# Altium schematic sheet DACN.SchDoc
size A
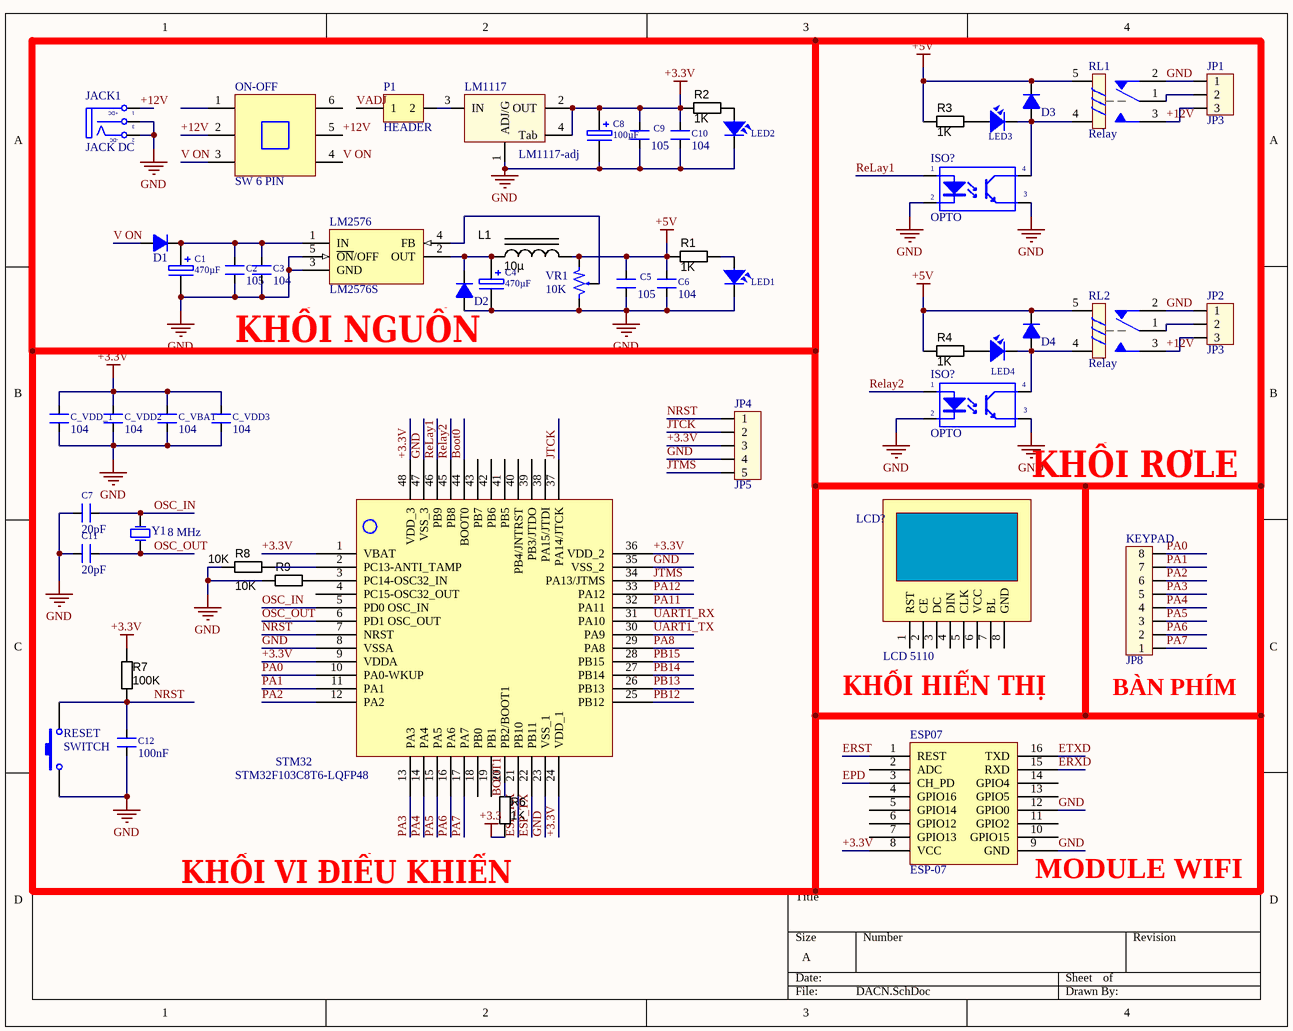
[diagram p0: DACN.SchDoc]

## Parts
(Parts that share a designator on the sheet are numbered #1, #2 ... from top to bottom, then left to right.)
C1  10µF  [CAP_ELEC_5x5.7]  (value not drawn)
C2  105  [SM-CAP-0805]
C3  104  [SM-CAP-0805]
C4  10µF  [CAP_ELEC_5x5.7]  (value not drawn)
C5  105  [SM-CAP-0805]
C6  104  [SM-CAP-0805]
C7  20pF  [SM-CAP-0805]
C8  10µF  [CAP_ELEC_5x5.7]  (value not drawn)
C9  105  [SM-CAP-0805]
C10  104  [SM-CAP-0805]
C11  20pF  [SM-CAP-0805]
C12  100nF  [SM-CAP-0805]
C_VBAT  104  [SM-CAP-0805]
C_VDD2  104  [SM-CAP-0805]
C_VDD3  104  [SM-CAP-0805]
C_VDD_1  104  [SM-CAP-0805]
D1  Diode  1N4007  [DO-214AC]  (value not drawn)
D2  Diode  1N4007  [DO-214AC]  (value not drawn)
D3  Diode  1N4007  [DO-214AC]  (value not drawn)
D4  Diode  1N4007  [DO-214AC]  (value not drawn)
ESP07  ESP-07  [ESP8266-07]
ISO?#1  OPTO  [PC817 SMD]
ISO?#2  OPTO  [PC817 SMD]
JACK1  JACK DC  [JACK DC]
JP1  JP3  [CON3]
JP2  JP3  [CON3]
JP4  JP5  [jam5]
KEYPAD  JP8  [jam8]
L1  10µ  [IND_WW_DR73]
LCD?  LCD 5110  [LCD 5110]
LED1  LED SMD  [SM-LED-0805-Blue]  (value not drawn)
LED2  LED SMD  [SM-LED-0805-Blue]  (value not drawn)
LED3  LED SMD  [SM-LED-0805-Blue]  (value not drawn)
LED4  LED SMD  [SM-LED-0805-Blue]  (value not drawn)
LM1117  LM1117-adj  [SOT223-4N]
LM2576  LM2576S  [TS5B]
ON-OFF  SW 6 PIN  [SW6]
P1  HEADER  [JUMPER PITCH 2 PIN]
R1  value 1K  [RESC2012N_ZERO]  (hidden comment: Jumper)
R2  value 1K  [RESC2012N_ZERO]  (hidden comment: Jumper)
R3  value 1K  [RESC2012N_ZERO]  (hidden comment: Jumper)
R4  value 1K  [RESC2012N_ZERO]  (hidden comment: Jumper)
R6  value 1K  [RESC2012N_ZERO]  (hidden comment: Jumper)
R7  value 100K  [RESC2012N_ZERO]  (hidden comment: Jumper)
R8  value 10K  [RESC2012N_ZERO]  (hidden comment: Jumper)
R9  value 10K  [RESC2012N_ZERO]  (hidden comment: Jumper)
RESET  SWITCH  [SW 4PIN]
RL1  Relay  [RL_SPDT_10A]
RL2  Relay  [RL_SPDT_10A]
STM32  STM32F103C8T6-LQFP48  [LQFP 48 PIN]
VR1  10K  [VR1]
Y1  8 MHz  [CRYSTAL DIP]

## Nets
+3.3: R6.1
+3.3V: C8.1 C9.2 C10.2 C_VBAT.2 C_VDD2.2 C_VDD3.2 C_VDD_1.2 ESP07.8(VCC) JP4.3 LM1117.2(OUT) LM1117.4(Tab) R2.1 R7.2 STM32.1(VBAT) STM32.9(VDDA) STM32.24(VDD_1) STM32.36(VDD_2) STM32.48(VDD_3)
+5V: C5.2 C6.2 D3.K D4.K L1.2 R1.1 R3.1 R4.1 RL1.5 RL2.5 VR1.1
GND: C1.2 C2.1 C3.1 C4.2 C5.1 C6.1 C7.2 C8.2 C9.1 C10.1 C11.2 C12.2 C_VBAT.1 C_VDD2.1 C_VDD3.1 C_VDD_1.1 D2.A ESP07.9(GND) ESP07.12(GPIO0) ISO?#1.2(K) ISO?#1.3(E) ISO?#2.2(K) ISO?#2.3(E) JACK1.2(TN) JACK1.3(S) JP1.1 JP2.1 JP4.4 LED1.2 LED2.2 LM1117.1(ADJ/G) LM2576.3(GND) LM2576.5(~{ON}/OFF) R8.2 R9.2 RESET.1 RL1.2 RL2.2 STM32.8(VSSA) STM32.23(VSS_1) STM32.35(VSS_2) STM32.47(VSS_3) VR1.3
+12V: JACK1.1(T) JP1.3 JP2.3 ON-OFF.2 ON-OFF.5 RL1.3 RL2.3
Boot0: STM32.44(BOOT0)
BOOT1: R6.2 STM32.20(PB2/BOOT1)
EPD: ESP07.3(CH_PD)
ERST: ESP07.1(REST)
ERXD: ESP07.15(RXD)
ESP_RX: STM32.21(PB10)
ESP_TX: STM32.22(PB11)
ETXD: ESP07.16(TXD)
JTCK: JP4.2 STM32.37(PA14/JTCK)
JTMS: JP4.5 STM32.34(PA13/JTMS)
NRST: C12.1 JP4.1 R7.1 RESET.2 STM32.7(NRST)
OSC_IN: C7.1 STM32.5(PD0_OSC_IN) Y1.2(OSC2)
OSC_OUT: C11.1 STM32.6(PD1_OSC_OUT) Y1.1(OSC1)
PA0: KEYPAD.8 STM32.10(PA0-WKUP)
PA1: KEYPAD.7 STM32.11(PA1)
PA2: KEYPAD.6 STM32.12(PA2)
PA3: KEYPAD.5 STM32.13(PA3)
PA4: KEYPAD.4 STM32.14(PA4)
PA5: KEYPAD.3 STM32.15(PA5)
PA6: KEYPAD.2 STM32.16(PA6)
PA7: KEYPAD.1 STM32.17(PA7)
PA8: STM32.29(PA8)
PA11: STM32.32(PA11)
PA12: STM32.33(PA12)
PB12: STM32.25(PB12)
PB13: STM32.26(PB13)
PB14: STM32.27(PB14)
PB15: STM32.28(PB15)
ReLay1: ISO?#1.1(A) STM32.46(PB9)
Relay2: ISO?#2.1(A) STM32.45(PB8)
UART1_RX: STM32.31(PA10)
UART1_TX: STM32.30(PA9)
V ON: D1.A ON-OFF.3 ON-OFF.4
VADJ: P1.1
NetC1_1: C1.1 C2.2 C3.2 D1.K LM2576.1(IN)
NetC4_1: C4.1 D2.K L1.1 LM2576.2(OUT)
NetD3_A: D3.A ISO?#1.4(C) LED3.2 RL1.4
NetD4_A: D4.A ISO?#2.4(C) LED4.2 RL2.4
NetJP1_2: JP1.2 RL1.1
NetJP2_2: JP2.2 RL2.1
NetLED1_1: LED1.1 R1.2
NetLED2_1: LED2.1 R2.2
NetLED3_1: LED3.1 R3.2
NetLED4_1: LED4.1 R4.2
NetLM1117_3: LM1117.3(IN) P1.2
NetLM2576_4: LM2576.4(FB) VR1.2
NetR8_1: R8.1 STM32.2(PC13-ANTI_TAMP)
NetR9_1: R9.1 STM32.3(PC14-OSC32_IN)

Not connected (* = marked no-connect by the designer): ESP07 2(ADC) 4(GPIO16) 5(GPIO14) 6(GPIO12) 7(GPIO13) 10(GPIO15) 11(GPIO2) 13(GPIO5) 14(GPIO4); LCD? 1(RST) 2(CE) 3(DC) 4(DIN) 5(CLK) 6(VCC) 7(BL) 8(GND); ON-OFF 1 6; STM32 4(PC15-OSC32_OUT) 18(PB0) 19(PB1) 38(PA15/JTDI) 39(PB3/JTDO) 40(PB4/JNTRST) 41(PB5) 42(PB6) 43(PB7)

## Notes on the sheet
- KHỐI NGUỒN
- (near ISO?#2) KHỐI RƠLE
- KHỐI HIỂN THỊ
- (near KEYPAD) BÀN PHÍM
- (near ESP07) MODULE WIFI
- (near R6) KHỐI VI ĐIỀU KHIỂN
- (in symbol CAP Aluminum) 470µF; 100µF
- (in symbol JACK DC) +DC; -DC

## Library data of the parts
C1 C4 C8 = CAP Aluminum
C2 C3 C5-C7 C9-C12 C_VBAT C_VDD2 C_VDD3 C_VDD_1 = CAP SMD: Value: 0,1uF/300V; Designed by: VanDungEvn
D1-D4 = Diode  1N4007: Diode 1A; Value: 1N4007
ISO?#1 ISO?#2 = OPTO: Value: TLP5211
JACK1 = JACK DC: Value: Jac DC
JP1 JP2 = Con3: Connector 3; Value: Connector 3
JP4 = jam 5: Value: Connector 5
KEYPAD = jam 8: Value: Connector 8
L1 = INDC_10u_DR73-100-R: Inductor Power 10µH 2.1A 7.6x7.6mm SMD; Manufacturer 1: Cooper Bussmann; Tolerance: ±20%; Material: ferrite shielded; SCDType: spec; Package / Case: 5.0x5.0x4.5mm; Ratings: 2.1 A; Supplier 1: Digi-Key; Supplier Part Number 1: 513-1129-1-ND; Manufacturer Part Number 1: DR73-100-R; ComponentLink1URL: http://www.cooperindustries.com/content/dam/public/bussmann/Electronics/Resources/Data%20Sheets/Bus_Elx_DS_4315_DR_Series.pdf; ComponentLink1Description: http://www.cooperindustries.com/content/dam/public/bussmann/Electronics/Resources/Data%20Sheets/Bus_Elx_DS_4315_DR_Series.pdf; Value: 10µ
LED1-LED4 = LED SMD 0805
LM1117 = LM1117-adj: 3v3; Value: LM317
LM2576 = LM2576S: Simple Switcher 3A Step Down Voltage Regulator; Note: Tab is connected to GND; Published: 15-Apr-2002; DatasheetVersion: Jun-1999; PackageReference: TS5B; Publisher: Altium Limited; PackageDescription: D2-PAK; 5 Leads; Body 14.4 (inc. leads) x 10.4 mm (LxW max); ComponentLink1Description: Manufacturer Link; ComponentLink1URL: http://www.national.com/; ComponentLink2Description: Datasheet; ComponentLink2URL: http://www.national.com/ds.cgi/LM/LM2576.pdf; ComponentLink3Description: URL Link1; ComponentLink3URL: http://www.national.com/pf/LM/LM2576.html
P1 = HEADER CONNECT
R1-R4 R6-R9 = RES_0805: Resistor SMD chip 0.0 Ohm 0.125W 0805; Manufacturer 1: Samsung Electro-Mechanics America, Inc; Manufacturer Part Number 1: RC2012J000CS; Ratings: 1/8W; SCDType: spec; Tolerance: N/A; Package / Case: 0805 (2012 metric); Supplier 1: Digi-Key; Supplier Part Number 1: 1276-5466-6-ND; RoHS 1: RoHS Compliant; ComponentLink1URL: http://www.samsungsem.com/servlet/FileDownload?filename=productcatalog/pdf/Chip_Resistor.pdf; ComponentLink1Description: http://www.samsungsem.com/servlet/FileDownload?filename=productcatalog/pdf/Chip_Resistor.pdf; Supplier 2: Digi-Key; Supplier Part Number 2: RMCF0805ZT0R00DKR-ND; Manufacturer 2: Stackpole Electronics Inc; Manufacturer Part Number 2: RMCF0805ZT0R00; RoHS 2: RoHS Compliant; ComponentLink2URL: http://www.seielect.com/Catalog/SEI-RMCF_RMCP.pdf; ComponentLink2Description: http://www.seielect.com/Catalog/SEI-RMCF_RMCP.pdf; Supplier 3: Digi-Key; Supplier Part Number 3: 311-0.0ARDKR-ND; Manufacturer 3: Yageo; Manufacturer Part Number 3: RC0805JR-070RL; RoHS 3: RoHS Compliant; ComponentLink3URL: http://media.digikey.com/pdf/Data%20Sheets/Yageo%20PDFs/RC0805%20Pb%20Free.pdf; ComponentLink3Description: http://media.digikey.com/pdf/Data%20Sheets/Yageo%20PDFs/RC0805%20Pb%20Free.pdf; Supplier 4: Digi-Key; Supplier Part Number 4: P0.0ADKR-ND; Manufacturer 4: Panasonic Electronic Components; Manufacturer Part Number 4: ERJ-6GEY0R00V; RoHS 4: RoHS Compliant; ComponentLink4URL: http://industrial.panasonic.com/www-cgi/jvcr13pz.cgi?E+PZ+3+AOA0001+ERJ6GEY0R00V+7+WW; ComponentLink4Description: http://industrial.panasonic.com/www-cgi/jvcr13pz.cgi?E+PZ+3+AOA0001+ERJ6GEY0R00V+7+WW; Supplier 5: Digi-Key; Supplier Part Number 5: RHM0.0CPDKR-ND; Manufacturer 5: Rohm Semiconductor; Manufacturer Part Number 5: MCR10ERTJ000; RoHS 5: RoHS Compliant; ComponentLink5URL: http://rohmfs.rohm.com/en/products/databook/datasheet/passive/resistor/chip_resistor/mcr_g.pdf; ComponentLink5Description: http://rohmfs.rohm.com/en/products/databook/datasheet/passive/resistor/chip_resistor/mcr_g.pdf
RL1 RL2 = Relay SRD: Relay SPDT 5 Pin; Value: Relay SPDT, 10A, 12V
VR1 = VR: Var Resistor RM065; RM065-503: 5K; RM065-103: 1K; RM065-104: 10K
Y1 = Crystal: Published: 8-Jun-2000; LatestRevisionDate: 17-Jul-2002; LatestRevisionNote: Re-released for DXP Platform.; PackageReference: R38; Publisher: Altium Limited
RESET = SWITCH: Published: 24-Mar-1999; LatestRevisionDate: 17-Jul-2002; LatestRevisionNote: Re-released for DXP Platform.; PackageReference: SPST-2; Publisher: Altium Limited
STM32 = STM32F103C8T6-LQFP48: Published: 30-May-2008; DatasheetVersion: rev6, Mar-2008; PackageVersion: Mar-2008; PackageReference: LQFP48; Publisher: Altium Limited; PackageDescription: 48-Pin Low-Profile Quad Flat Pack, 7 x 7 mm Body, 0.5 mm Pitch (LQFP48); ComponentLink1Description: Manufacturer Link; ComponentLink1URL: www.st.com/stm32; ComponentLink2Description: Datasheet; ComponentLink2URL: http://www.st.com/stonline/products/literature/ds/13586.pdf